# EAGLE design EXM Safety Stop - Rev A1 (EAGLE 7.7.0)
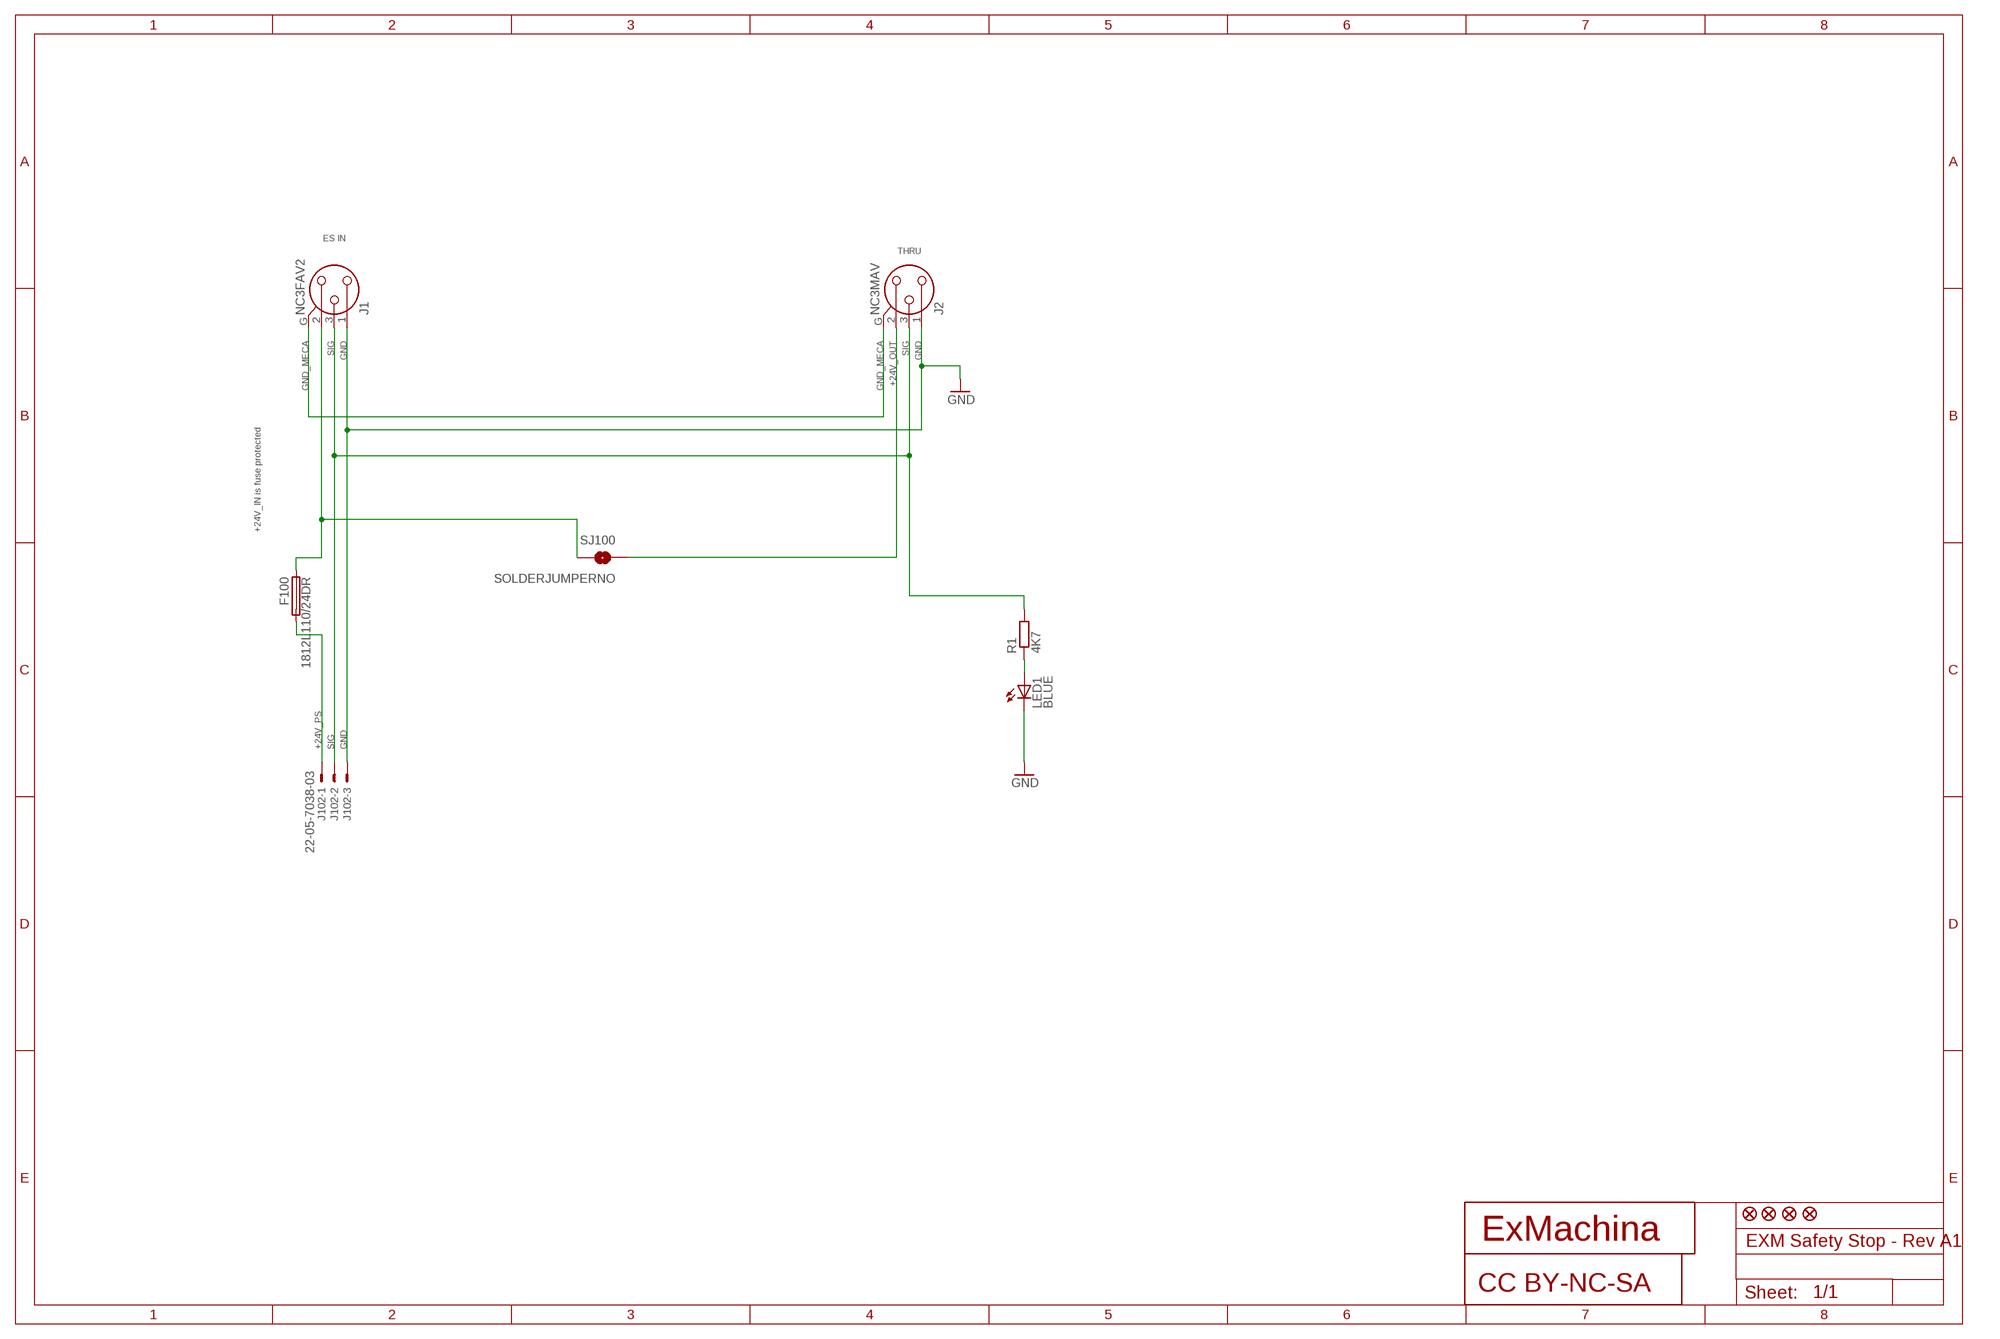
[diagram p0: schematic, sheet 1]

## Parts
CC100  CC-BY-NC-SA  [CC-BY-NC-SA]
F100  1812L110/24DR  [LITTLEFUSE_SMD]
J1  NC3FAV2  [NC3FAV2]
J2  NC3MAV  [NC3MAV]
J102  22-05-7038-03  [7395-03]
JP100  FIDUCIAL1X2  [FIDUCIAL-1X2]
JP101  FIDUCIAL1X2  [FIDUCIAL-1X2]
JP102  FIDUCIAL1X2  [FIDUCIAL-1X2]
JP103  FIDUCIAL1X2  [FIDUCIAL-1X2]
LED1  BLUE  LEDCHIPLED_0603  [CHIPLED_0603]
R1  4K7  R-EU_R0603  [R0603]
SJ100  SOLDERJUMPERNO  [SJ_2S-NO]
T100  EXMACHINA-LOGO-NAME  [EXM-LOGO-BASELINE]

## Nets
+24V_IN: F100.1 J1.2 SJ100.2
+24V_OUT: J2.2 SJ100.1
+24V_PS: F100.2 J102.1
GND: J1.1 J2.1 J102.3 LED1.C
GND_MECA: J1.G J2.G
N$2: LED1.A R1.1
SIG: J1.3 J2.3 J102.2 R1.2

## Notes on the sheet
- ES IN
- THRU
- +24V_IN is fuse protected

## Library data of the parts
CC100 = cc-by-sa:CC-BY-NC-SA; OC_NEWARK: unknown
F100 = fuse2:1812L; MPN: 1812L110/24DR; OC_NEWARK: 39X0319
J1 = con-neutrik_ag:NC3: Neutrik Audio Connector XLR SERIES Stereo 1/4" jack Source: www.neutrik.com/; MF: NEUTRIK; MPN: NC3FAV2; OC_FARNELL: unknown; OC_NEWARK: 83F7211
J2 = con-neutrik_ag:NC3: Neutrik Audio Connector XLR SERIES Stereo 1/4" jack Source: www.neutrik.com/; MF: FARNELL; MPN: NC3MAV; OC_FARNELL: 724531; OC_NEWARK: 46WX3058
J102 = con-molex:22-?-03: CONNECTOR wire to board 2.54 mm (.1 inch) pitch header; OC_FARNELL: 9731610; OC_NEWARK: unknown
JP100-JP103 = SparkFun:FIDUCIAL: Fiducial Alignment Points Various fiducial points for machine vision alignment.; OC_NEWARK: unknown
LED1 = led:LED: LED OSRAM: - CHIPLED LG R971, LG N971, LY N971, LG Q971, LY Q971, LO R971, LY R971 LH N974, LH R974 LS Q976, LO Q976, LY Q976 LO Q996 - Hyper CHIPLED LW Q18S LB Q993, LB Q99A, LB R99A - SideLED LS A670, LO A670, LY A670, LG A670, LP A670 LB A673, LV A673, LT A673, LW A673 LH A674 LY A675 LS A676, LA A676, LO A676, LY A676, LW A676 LS A679, LY A679, LG A679 - Hyper Micro SIDELED® LS Y876, LA Y876, LO Y876, LY Y876 LT Y87S - SmartLED LW L88C, LW L88S LB L89C, LB L89S, LG L890 LS L89K, LO L89K, LY L89K LS L896, LA L896, LO L896, LY L896 - TOPLED LS T670, LO T670, LY T670, LG T670, LP T670 LSG T670, LSP T670, LSY T670, LOP T670, LYG T670 LG T671, LOG T671, LSG T671 LB T673, LV T673, LT T673, LW T673 LH T674 LS T676, LA T676, LO T676, LY T676, LB T676, LH T676, LSB T676, LW T676 LB T67C, LV T67C, LT T67C, LS T67K, LO T67K, LY T67K, LW E67C LS E67B, LA E67B, LO E67B, LY E67B, LB E67C, LV E67C, LT E67C LW T67C LS T679, LY T679, LG T679 LS T770, LO T770, LY T770, LG T770, LP T770 LB T773, LV T773, LT T773, LW T773 LH T774 LS E675, LA E675, LY E675, LS T675 LS T776, LA T776, LO T776, LY T776, LB T776 LHGB T686 LT T68C, LB T68C - Hyper Mini TOPLED® LB M676 - Mini TOPLED Santana® LG M470 LS M47K, LO M47K, LY M47K Source: http://www.osram.convergy.de LUXEON: - LUMILED® LXK2-PW12-R00, LXK2-PW12-S00, LXK2-PW14-U00, LXK2-PW14-V00 LXK2-PM12-R00, LXK2-PM12-S00, LXK2-PM14-U00 LXK2-PE12-Q00, LXK2-PE12-R00, LXK2-PE12-S00, LXK2-PE14-T00, LXK2-PE14-U00 LXK2-PB12-K00, LXK2-PB12-L00, LXK2-PB12-M00, LXK2-PB14-N00, LXK2-PB14-P00, LXK2-PB14-Q00 LXK2-PR12-L00, LXK2-PR12-M00, LXK2-PR14-Q00, LXK2-PR14-R00 LXK2-PD12-Q00, LXK2-PD12-R00, LXK2-PD12-S00 LXK2-PH12-R00, LXK2-PH12-S00 LXK2-PL12-P00, LXK2-PL12-Q00, LXK2-PL12-R00 Source: www.luxeon.com KINGBRIGHT: KA-3528ASYC Source: www.kingbright.com; MPN: OVS-0603; OC_NEWARK: 15R2205
R1 = rcl:R-EU_: RESISTOR, European symbol; MPN: RC0603FR-074K7L; OC_NEWARK: 68R0092
SJ100 = SparkFun-Passives:SOLDERJUMPER: Solder Jumper Standard SMD solder jumper. Used to automate production. Two varients : Normally Open and Normally Closed are the same, but have different paste layers. NC will have a large amount of paste and should jumper during reflow.; OC_NEWARK: unknown
T100 = exmachina:EXMACHINA-LOGO; OC_NEWARK: unknown

## Net classes
0 default: width 0.813 mm, drill 0.5 mm

## Board
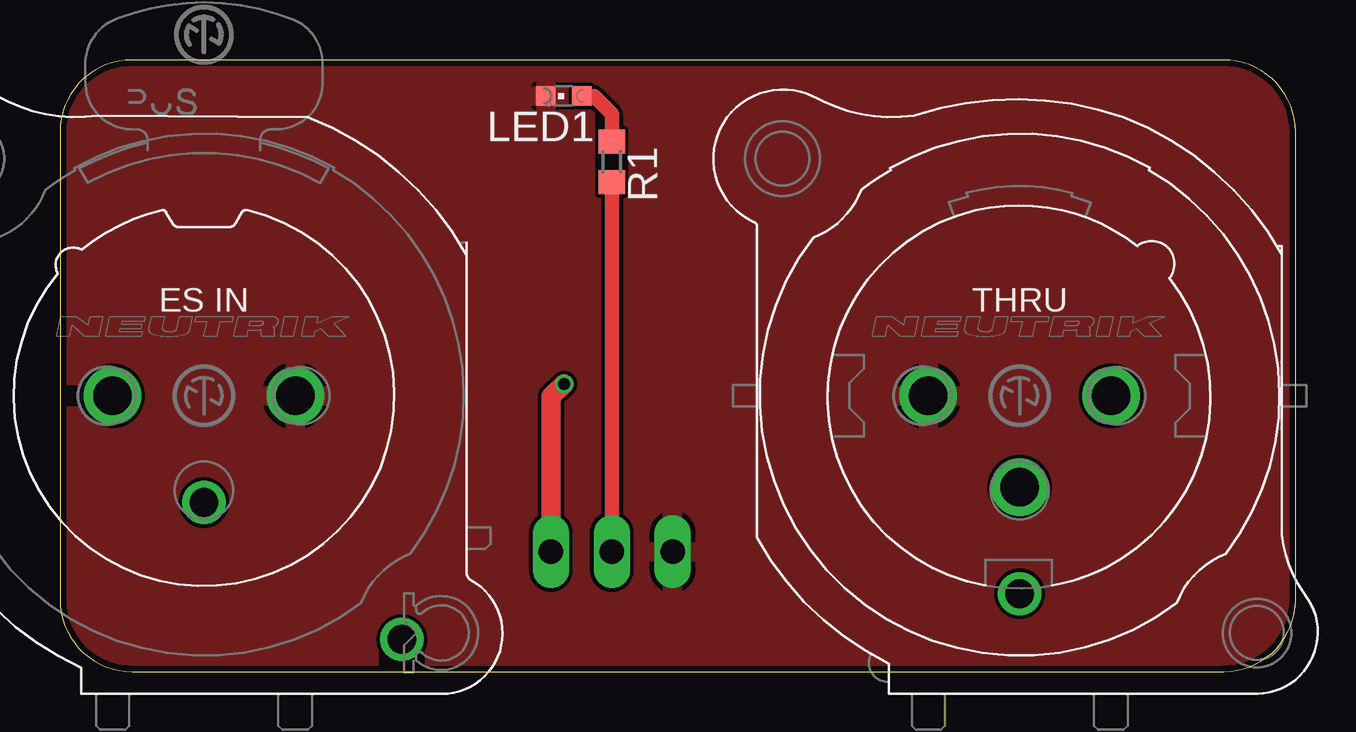
[diagram p1: board, top side]
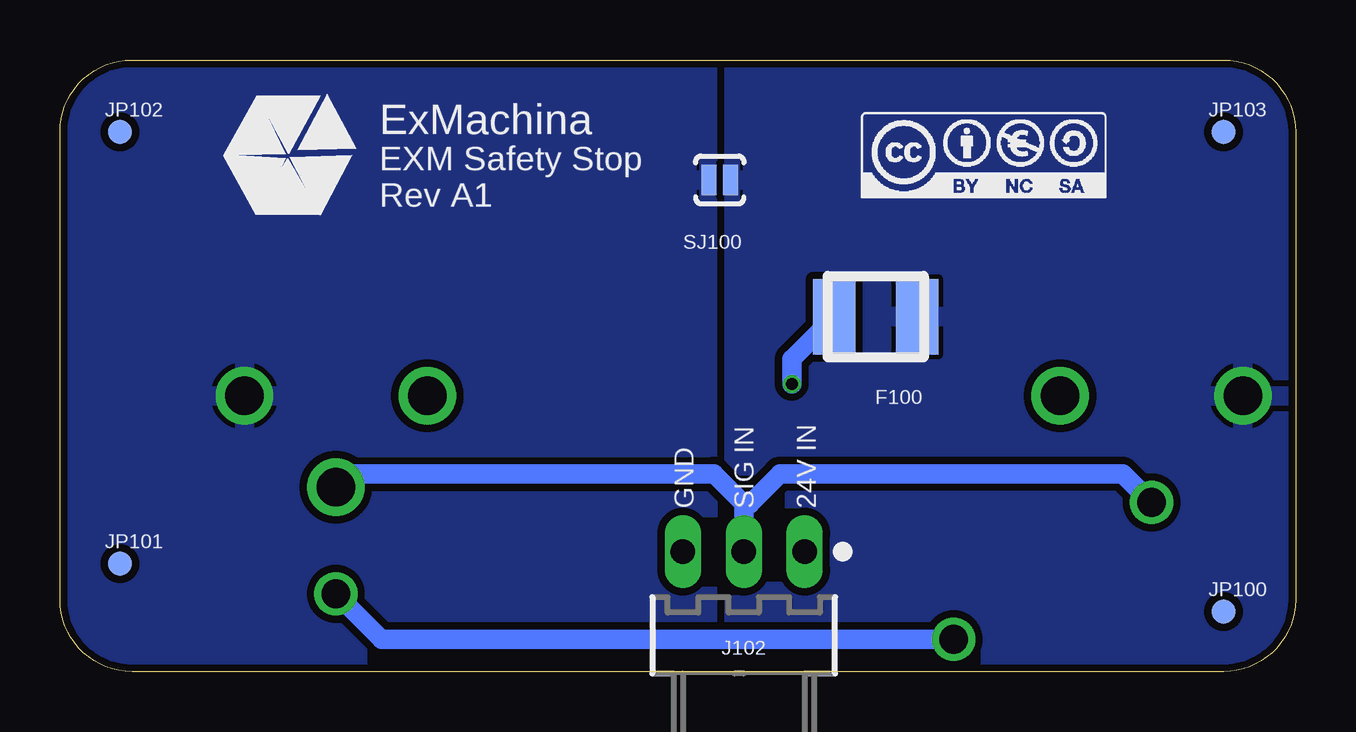
[diagram p2: board, bottom side, seen from below]

Size 51.5 x 25.5 mm. Coordinates in mm from the lower left corner, seen from the top.
Outline: 51.5,3 51.5,22.5 arc90 48.5,25.5 3,25.5 arc90 0,22.5 0,3 arc90 3,0 48.5,0 arc90 51.5,3
Copper layers (1*16): Top 0.018mm / dielectric 1.55mm / Bottom 0.018mm
Design rules "eC_2Layer_PClass6_BaseCopperO18_eCDefault *": minimum track width 0.15mm, minimum drill 0.35mm, track to track 0.15mm, track to pad 0.15mm, pad to pad 0.15mm, via to via 0.15mm, smd to smd 0mil, copper to edge 0.25mm, drill to drill 0.35mm, minimum pad ring 0.175mm, minimum via ring 0.125mm, stop-mask expansion 0mil, vias tented up to drill 0.45mm, thermal gap 0.2mm

### Footprints (pad centres in the part's own frame; a part is rotated, then mirrored left to right if it is on the bottom)
LITTLEFUSE_SMD = smd 1.78 x 3.15: 1 -1.725,0; 2 1.725,0
NC3FAV2 = drill 1.6: 1 3.81,0; 2 -3.81,0 | drill 1.2: 3 0,-4.45; G 8.25,-10.16
NC3MAV = drill 1.6: 1 -3.81,0; 2 3.81,0; 3 0,-3.81 | drill 1.2: G 0,-8.255
7395-03 = drill 1.016 long: 1 2.54,0; 2 0,0; 3 -2.54,0
FIDUCIAL-1X2 = smd 1 x 1: 1 0,0
CHIPLED_0603 = smd 0.8 x 0.8: A 0,-0.75; C 0,0.75
R0603 = smd 1 x 1.1: 1 -0.85,0; 2 0.85,0
SJ_2S-NO = smd 0.635 x 1.27: 1 -0.45,0; 2 0.45,0

### Placement (x,y rotation side)
CC100  13,21.5 0 bottom
F100  17.5,14.8 180 bottom
J1  6,11.5 0 top
J2  40,11.5 0 top
J102  23,5 0 bottom
JP100  3,2.5 0 bottom
JP101  49,4.5 0 bottom
JP102  49,22.5 0 bottom
JP103  3,22.5 0 bottom
LED1  21,24 90 top
R1  23,21.25 270 top
SJ100  24,20.5 0 bottom
T100  42,21.5 0 bottom
U$1  [A4L-LOC]  -95,-71 0 top  (outside the outline)

### Tracks (layer width: path | path; a pad name or v marks a point on that pad's centre or on a via)
+24V_IN
  pour Bottom (isolate 0.305): -4,26.5 23.4,26.5 23.4,-1.5 -4,-1.5
+24V_OUT
  pour Bottom (isolate 0.305, rank 3): 53,26.5 24.5,26.5 24.5,-1.5 53,-1.5
+24V_PS  (via drill 0.5)
  Top 0.813: J102.1 20.46,11.46 v21,12 20.54,11.54
  Bottom 0.813: v21,12 21,13.03 F100.2
GND
  pour Top: -5,27.5 54,27.5 54,-2.5 -5,-2.5
GND_MECA
  Bottom 0.813: J1.G 38.09,1.34 J2.G
N$2
  Top 0.61: LED1.A 22.25,24 23,23.25 R1.1
SIG
  Top 0.61: R1.2 J102.2
  Bottom 0.813: J1.3 7.2,8.25 21.5,8.25 22.75,7 23,7 | J2.3 39.44,8.25 24.25,8.25 23,7 | 23,7 J102.2

### Text on the board
tPlace: ES IN | THRU
bPlace: EXM Safety Stop / Rev A1 | 24V IN | SIG IN | GND